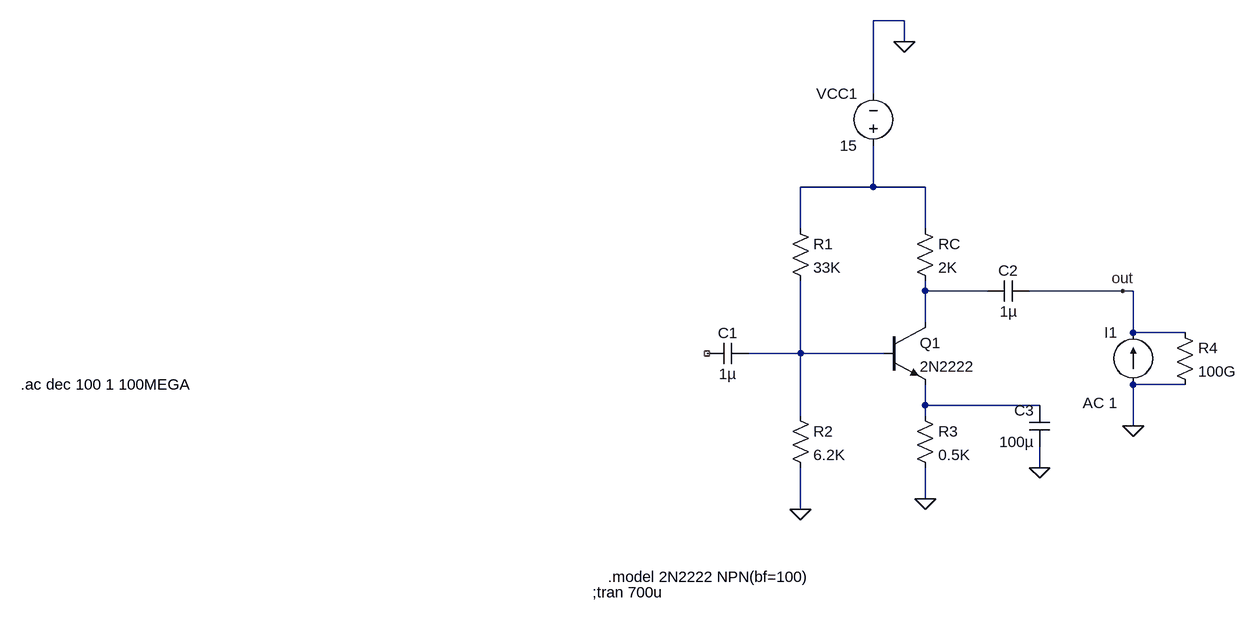
[diagram p0: schematic Single Stage BJT Ampr for impedance.asc]
Single Stage BJT Ampr for impedance.asc, the LTspice schematic file:
Version 4
SHEET 1 916 680
WIRE 400 -224 352 -224
WIRE 400 -192 400 -224
WIRE 352 -112 352 -224
WIRE 352 32 352 -32
WIRE 352 32 240 32
WIRE 432 32 352 32
WIRE 240 96 240 32
WIRE 432 96 432 32
WIRE 432 192 432 176
WIRE 528 192 432 192
WIRE 736 192 592 192
WIRE 752 192 736 192
WIRE 432 240 432 192
WIRE 752 256 752 192
WIRE 832 256 752 256
WIRE 240 288 240 176
WIRE 240 288 160 288
WIRE 368 288 240 288
WIRE 832 336 752 336
WIRE 432 368 432 336
WIRE 608 368 432 368
WIRE 240 384 240 288
WIRE 432 384 432 368
WIRE 752 400 752 336
WIRE 608 464 608 432
WIRE 432 512 432 464
WIRE 240 528 240 464
FLAG 752 400 0
FLAG 240 528 0
FLAG 432 512 0
FLAG 608 464 0
FLAG 400 -192 0
FLAG 736 192 out
SYMBOL voltage 352 -16 R180
WINDOW 0 24 96 Left 2
WINDOW 3 24 16 Left 2
WINDOW 123 0 0 Left 0
WINDOW 39 0 0 Left 0
SYMATTR InstName VCC1
SYMATTR Value 15
SYMBOL cap 160 272 R90
WINDOW 0 0 32 VBottom 2
WINDOW 3 32 32 VTop 2
SYMATTR InstName C1
SYMATTR Value 1µ
SYMBOL cap 592 176 R90
WINDOW 0 0 32 VBottom 2
WINDOW 3 32 32 VTop 2
SYMATTR InstName C2
SYMATTR Value 1µ
SYMBOL cap 624 432 R180
WINDOW 0 24 56 Left 2
WINDOW 3 24 8 Left 2
SYMATTR InstName C3
SYMATTR Value 100µ
SYMBOL res 224 80 R0
SYMATTR InstName R1
SYMATTR Value 33K
SYMBOL res 224 368 R0
SYMATTR InstName R2
SYMATTR Value 6.2K
SYMBOL res 416 80 R0
SYMATTR InstName RC
SYMATTR Value 2K
SYMBOL res 416 368 R0
SYMATTR InstName R3
SYMATTR Value 0.5K
SYMBOL npn 368 240 R0
SYMATTR InstName Q1
SYMATTR Value 2N2222
SYMBOL current 752 336 R180
WINDOW 0 24 80 Left 2
WINDOW 3 24 0 Left 2
WINDOW 123 24 -28 Left 2
WINDOW 39 0 0 Left 0
SYMATTR InstName I1
SYMATTR Value ""
SYMATTR Value2 AC 1
SYMBOL res 816 240 R0
SYMATTR InstName R4
SYMATTR Value 100G
TEXT -56 632 Left 2 !.model 2N2222 NPN(bf=100)
TEXT -80 656 Left 2 !;tran 700u
TEXT -56 632 Invisible 2 !.model 2N2222 NPN(bf=100)
TEXT -960 336 Left 2 !.ac dec 100 1 100MEGA

The netlist it stands for:
* Single Stage BJT Ampr for impedance.asc
VCC1 N001 0 15
C1 N003 NC_01 1µ
C2 out N002 1µ
C3 0 N004 100µ
R1 N001 N003 33K
R2 N003 0 6.2K
RC N001 N002 2K
R3 N004 0 0.5K
Q1 N002 N003 N004 0 2N2222
I1 0 out AC 1
R4 out 0 100G
.model NPN NPN
.model PNP PNP
.lib standard.bjt
.model 2N2222 NPN(bf=100)
;tran 700u
.model 2N2222 NPN(bf=100)
.ac dec 100 1 100MEGA
.backanno
.end